# EasyEDA Pro project ProPrj_8.29_2025-09-02.epro

# Schematic Schematic1
Board Name: Board1; Create Date: 2025-08-29; Page Name: P1; Project Name: 8.29; Schematic Name: Schematic1; Update Date: 2025-08-29; Company: 嘉立创EDA; Page Size: A4; Version: V1.0
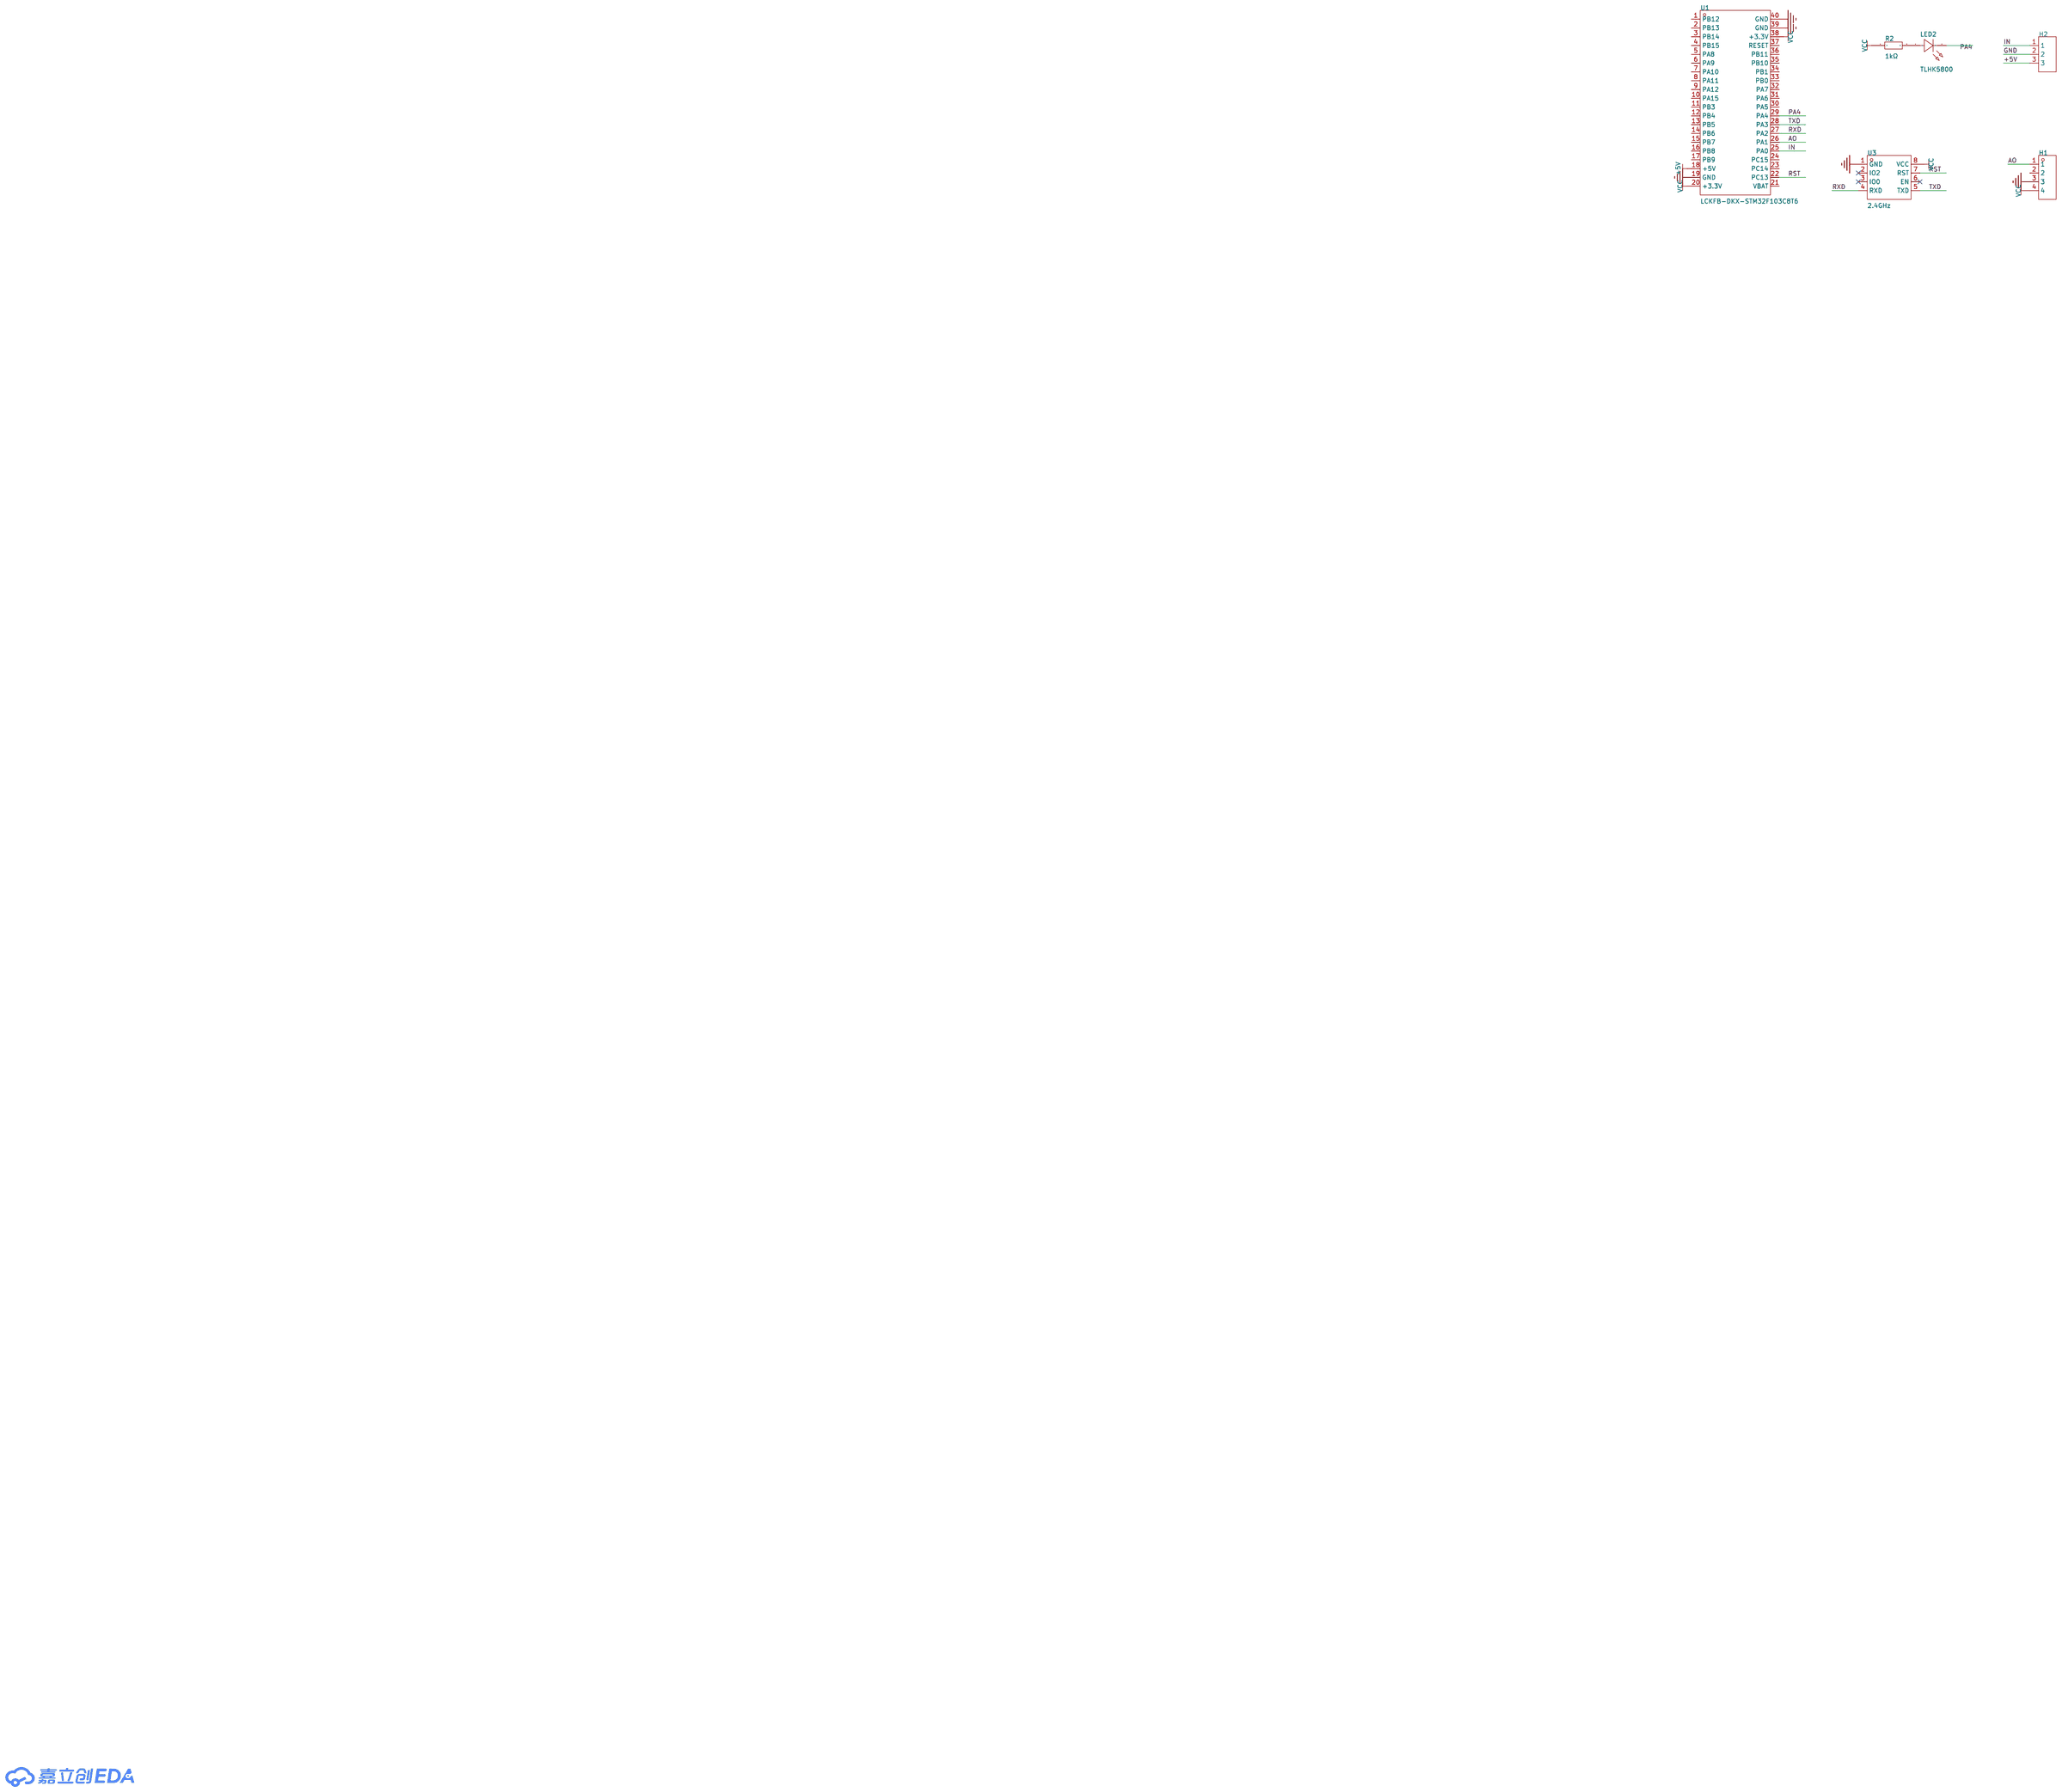
[diagram p0: schematic sheet]

## Parts
H1  -  [HDR-TH_4P-P2.54-V-F]
H2  -  [HDR-TH_3P-P2.54-V-F]
LED2  TLHK5800  [LED-TH_BD5.0-P2.54-RD]
R2  1kΩ  [RES-TH_BD2.5-L6.5-P10.50-D0.6]
U1  LCKFB-DKX-STM32F103C8T6  [CONN-TH_L53.3-W22.9_STM32F103C8T6-CARD]
U3  2.4GHz  [WIFIM-TH_8P-L24.7-W14.4-P2.54]

## Library data of the parts
H1 = HDR-F_2.54_1x4P: Supplier Part: C2718488; Supplier Footprint: 插件
H2 = HDR-F_2.54_1x3P: Supplier Part: C541850; Supplier Footprint: 插件
LED2 = TLHK5800: 发光颜色:红色;正向压降(Vf):1.9V;功率:80mW;正向电流:20mA;波长:630nm;透镜颜色:无色透明透镜;发光强度:5500mcd;发光角度:8°;工作温度:-40℃~+100℃;; Supplier Part: C7400546; Manufacturer: VISHAY(威世); Supplier Footprint: 插件; JLCPCB Part Class: 扩展库; Datasheet: https://item.szlcsc.com/datasheet/TLHK5800/8372711.html; Supplier: LCSC; Illumination Color: 红色; Voltage - Forward(Vf): 1.9V; Power(Watts): 80mW; Forward Current: 20mA; Wavelength - Dominant: 630nm; Peak Wavelength: 643nm; Lens Color: 无色透明透镜; Luminous Intensity: 5500mcd; Viewing Angle: 8°; Operating Temperature: -40℃~+100℃
R2 = MFR0W4F1001A50: 电阻类型:金属膜电阻;阻值:1kΩ;精度:±1%;功率:250mW;温度系数:±50ppm/℃;; LCSC Part Name: 1kΩ ±1% 250mW 金属膜电阻 铜脚，圆柱状直插; Supplier Part: C57435; Manufacturer: UNI-ROYAL(厚声); Supplier Footprint: 插件,D2.2xL6.5mm; JLCPCB Part Class: 扩展库; Datasheet: https://atta.szlcsc.com/upload/public/pdf/source/20191012/C436293_8820AA14BC71FA35E551C06C441482A0.pdf; Supplier: LCSC; Type: 金属膜电阻; Tolerance: ±1%; Voltage-Supply(Max): 250V; Power(Watts): 250mW; Temperature Coefficient: ±50ppm/℃
U1 = LCKFB-DKX-STM32F103C8T6: LCSC Part Name: 立创·地阔星-STM32F103C8T6开发板; Supplier Part: C22396880; Manufacturer: 立创开发板; JLCPCB Part Class: 扩展库; Datasheet: https://item.szlcsc.com/datasheet/LCKFB-DKX-STM32F103C8T6/24005615.html; Supplier: LCSC
U3 = ESP-01S: 核心处理器:ESP8266芯片;频率:2.4GHz;天线形式:板载PCB天线;发射功率:16dBm;接收灵敏度:-90dBm;; LCSC Part Name: 完整的802.11b/g/nWi-FiSoC模块; Supplier Part: C503582; Manufacturer: Ai-Thinker(安信可); JLCPCB Part Class: 扩展库; Datasheet: https://atta.szlcsc.com/upload/public/pdf/source/20200407/C503582_1139AF8FB42E05635FA0089E1752A536.pdf; Supplier: LCSC; Core Processor: ESP8266芯片; Support Interface: GPIO；UART；PWM; Antenna Type: 板载PCB天线; Output Power: 16dBm; Operating Voltage: 3V~3.6V; Receive  Current: 56mA; Send  Current: 170mA; Sensitivity: -90dBm; Operating Temperature: -20℃~+70℃

## Nets
+5V: H2.3 U1.18(+5V)
GND: H1.3 H2.2 U1.19(GND) U1.39(GND) U1.40(GND) U3.1(GND)
VCC: H1.4 R2.1 U1.20(+3.3V) U1.38(+3.3V) U3.8(VCC)
AO: H1.1 U1.26(PA1)
IN: H2.1 U1.25(PA0)
PA4: LED2.2(K) U1.29(PA4)
RST: U1.22(PC13) U3.7(RST)
RXD: U1.27(PA2) U3.4(RXD)
TXD: U1.28(PA3) U3.5(TXD)
$1N1094: LED2.1(A) R2.2

Not connected (* = marked no-connect by the designer): H1 2; U1 1(PB12) 2(PB13) 3(PB14) 4(PB15) 5(PA8) 6(PA9) 7(PA10) 8(PA11) 9(PA12) 10(PA15) 11(PB3) 12(PB4) 13(PB5) 14(PB6) 15(PB7) 16(PB8) 17(PB9) 21(VBAT) 23(PC14) 24(PC15) 30(PA5) 31(PA6) 32(PA7) 33(PB0) 34(PB1) 35(PB10) 36(PB11) 37(RESET); U3 2(IO2)* 3(IO0)* 6(EN)*

# Board PCB1
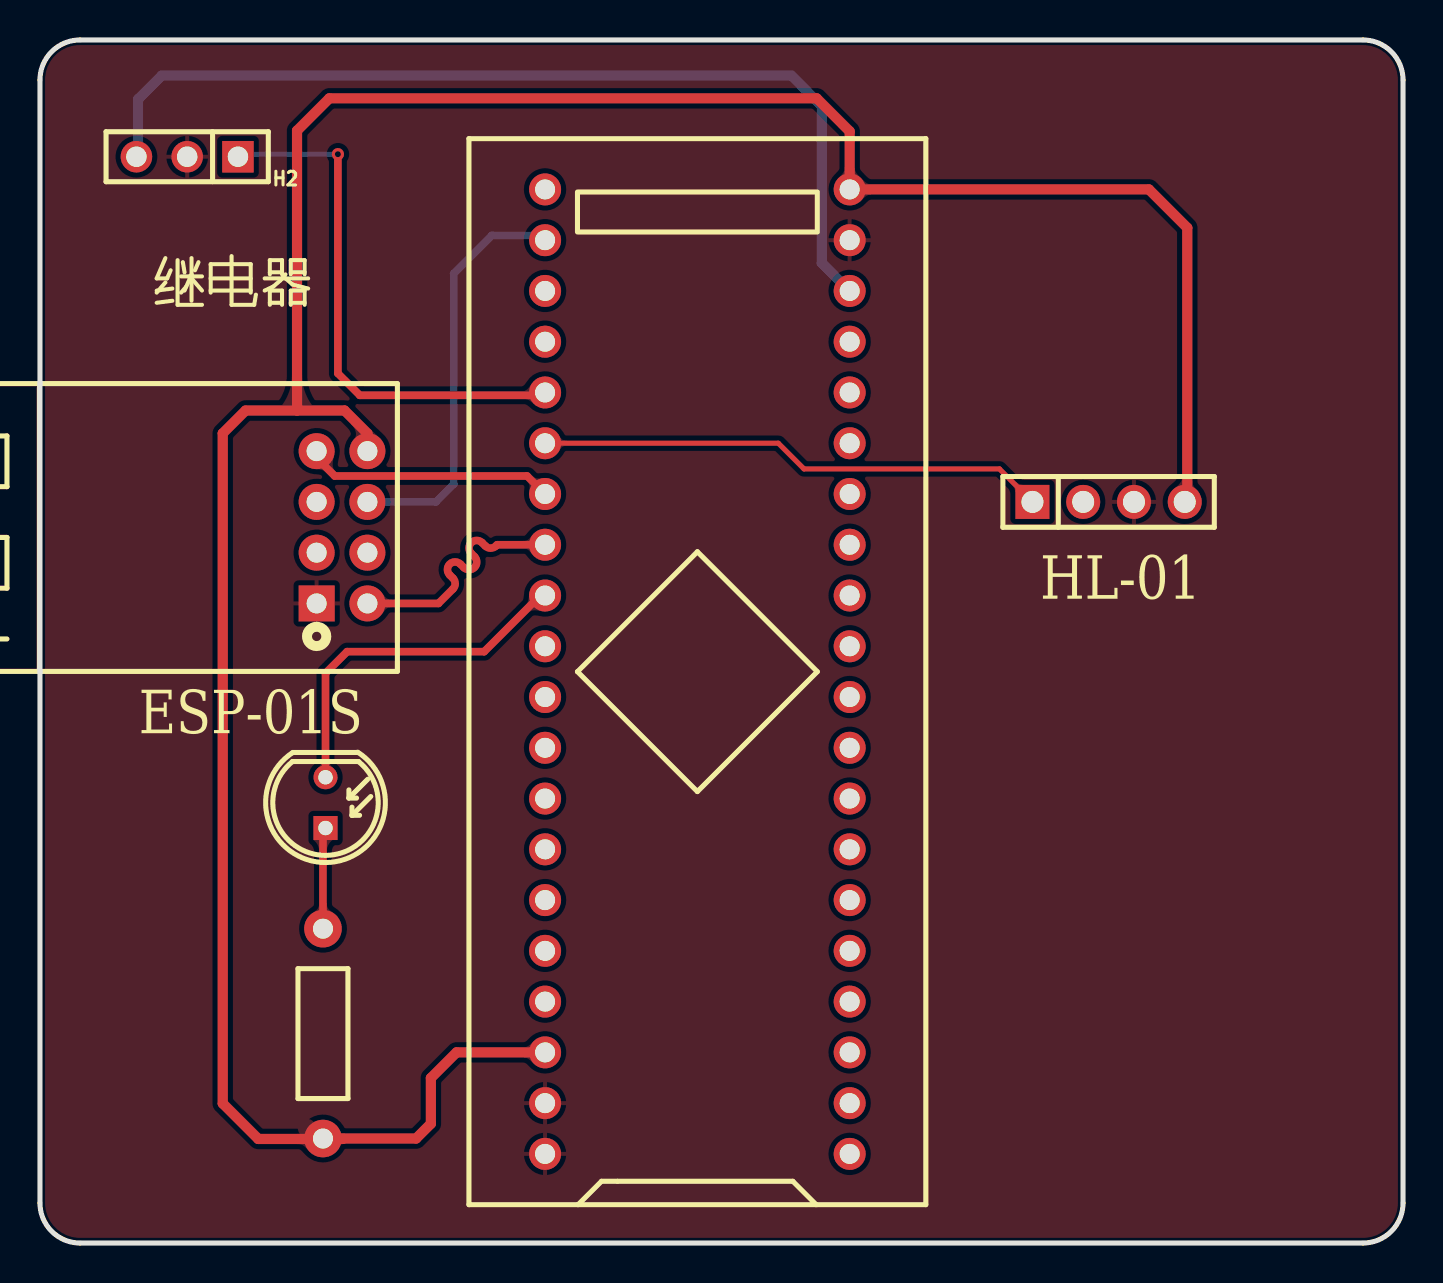
[diagram p1: board, top side]
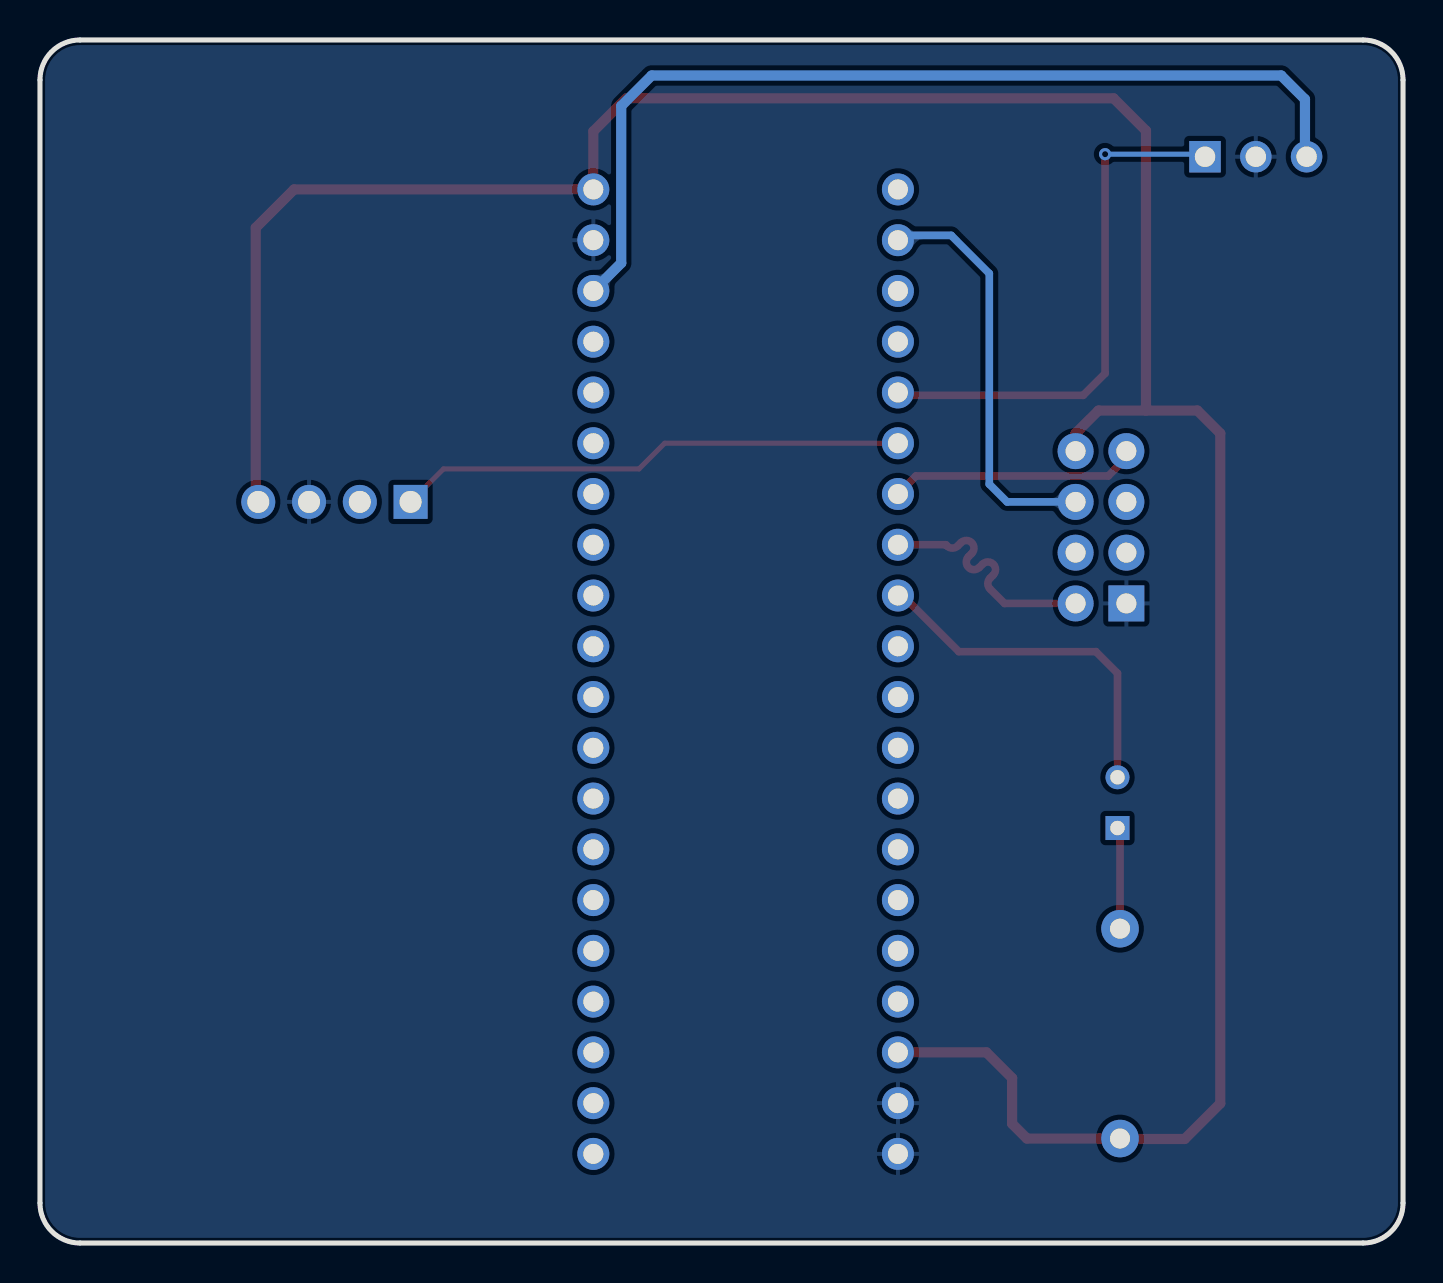
[diagram p2: board, bottom side, seen from below]

Outline 68.2 x 60.2 mm; copper layers: Top Layer, Bottom Layer. Coordinates in mm from the lower left corner of the outline.
Outline path: 0,58.2 0,2 arc(0.59,0.59) 2,0 66.2,0 arc(67.61,0.59) 68.2,2 68.2,58.2 arc(67.61,59.61) 66.2,60.2 2,60.2 arc(0.59,59.61) 0,58.2
Stack: Top Layer 0.035mm / Dielectric1 1.51mm FR4 er 4.5 / Bottom Layer 0.035mm

## Design rules (mm)
net RXD: DP1
net TXD: DP1
template: JLCPCB Capability(Two Layers Board)
spacing copperThickness1oz (default): track to track 0.102, other pairs 0.152 to 0.3
spacing copperThickness2oz: track to track 0.203, other pairs 0.152 to 0.3
track width copperThickness1oz (default): min 0.127, default 0.254, max 2.54
track width copperThickness2oz: min 0.203, default 0.254, max 2.54
differential pair differentialPair (default): width min 0.127, default 0.254, max 2.54; gap min 0.152, default 0.152
via viaSize (default): diameter min 0.5, default 0.61, max 10; hole min 0.3, default 0.305, max 6.3

## Placement (name value [footprint] x y rotation side)
H1  -  [HDR-TH_4P-P2.54-V-F]  53.47 37.08 0 top
H2  -  [HDR-TH_3P-P2.54-V-F]  7.37 54.36 180 top
LED2  TLHK5800  [LED-TH_BD5.0-P2.54-RD]  14.29 22.04 270 top
R2  1kΩ  [RES-TH_BD2.5-L6.5-P10.50-D0.6]  14.16 10.48 90 top
U1  LCKFB-DKX-STM32F103C8T6  [CONN-TH_L53.3-W22.9_STM32F103C8T6-CARD]  32.89 28.59 90 top
U3  2.4GHz  [WIFIM-TH_8P-L24.7-W14.4-P2.54]  15.11 35.81 180 top

## Footprints (pads in the part's own frame, mm; a bottom-side part is the same pattern mirrored in y, then rotated)
CONN-TH_L53.3-W22.9_STM32F103C8T6-CARD
  round 1.6 hole 1: 1(-24.13,-7.62) 2(-21.59,-7.62) 3(-19.05,-7.62) 4(-16.51,-7.62) 5(-13.97,-7.62) 6(-11.43,-7.62) 7(-8.89,-7.62) 8(-6.35,-7.62) 9(-3.81,-7.62) 10(-1.27,-7.62) 11(1.27,-7.62) 12(3.81,-7.62) 13(6.35,-7.62) 14(8.89,-7.62) 15(11.43,-7.62) 16(13.97,-7.62) 17(16.51,-7.62) 18(19.05,-7.62) 19(21.59,-7.62) 20(24.13,-7.62) 21(24.13,7.62) 22(21.59,7.62) 23(19.05,7.62) 24(16.51,7.62) 25(13.97,7.62) 26(11.43,7.62) 27(8.89,7.62) 28(6.35,7.62) 29(3.81,7.62) 30(1.27,7.62) 31(-1.27,7.62) 32(-3.81,7.62) 33(-6.35,7.62) 34(-8.89,7.62) 35(-11.43,7.62) 36(-13.97,7.62) 37(-16.51,7.62) 38(-19.05,7.62) 39(-21.59,7.62) 40(-24.13,7.62)
HDR-TH_3P-P2.54-V-F
  rect 1.575x1.575 hole 1.02: 1(-2.54,0)
  round 1.575 hole 1.02: 2(0,0) 3(2.54,0)
HDR-TH_4P-P2.54-V-F
  rect 1.7x1.7 hole 1.1: 1(-3.81,0)
  round 1.7 hole 1.1: 2(-1.27,0) 3(1.27,0) 4(3.81,0)
LED-TH_BD5.0-P2.54-RD
  rect 1.2x1.2 hole 0.72: 1(1.27,0)
  round 1.2 hole 0.72: 2(-1.27,0)
RES-TH_BD2.5-L6.5-P10.50-D0.6
  round 1.879 hole 1: 1(-5.25,0) 2(5.25,0)
WIFIM-TH_8P-L24.7-W14.4-P2.54
  rect 1.8x1.8 hole 1: 1(1.27,3.81)
  round 1.8 hole 1: 2(1.27,1.27) 3(1.27,-1.27) 4(1.27,-3.81) 5(-1.27,3.81) 6(-1.27,1.27) 7(-1.27,-1.27) 8(-1.27,-3.81)

## Nets
As in the schematic.

Pads without a net: H1 2; U1 1 2 3 4 5 6 7 8 9 10 11 12 13 14 15 16 17 21 23 24 30 31 32 33 34 35 36 37; U3 2 3 6

## Via types
v1: diameter 0.61, hole 0.305, Top Layer to Bottom Layer, 1 via

## Routing (per net, layer and track width the routed paths; a pad name or vN(x,y) marks a point on that pad's centre or on a via; arc(x,y) is an arc through that point)
+5V: length 47.9
  Bottom Layer w0.508: 4.91,54.48 4.91,57.23 6.1,58.42 37.59,58.42 39.12,56.9 39.12,49.04 U1.18
VCC: length 140
  Top Layer w0.508: 12.86,41.66 12.86,55.66 14.48,57.28 38.86,57.28 40.51,55.63 U1.20 55.48,52.72 57.4,50.8 57.4,37.21 H1.4 ; 12.86,41.66 10.29,41.66 9.14,40.51 9.14,6.99 10.92,5.21 15.13,5.21 15.16,5.23 18.82,5.23 19.56,5.97 19.56,8.25 20.84,9.54 U1.38 ; 12.86,41.66 15.24,41.66 16.38,40.51 U3.8
AO: length 25.6
  Top Layer w0.254: H1.1 48.01,38.73 38.23,38.73 36.94,40.02 U1.26
IN: length 26.9
  Top Layer w0.381: U1.25 25.13,42.42 16,42.42 14.91,43.51 v1(14.91,54.48)
  Bottom Layer w0.254: v1(14.91,54.48) 10.03,54.48 H2.1
PA4: length 17.8
  Top Layer w0.381: LED2.2 14.29,28.51 15.37,29.59 22.22,29.59 25.03,32.4 U1.29
RST: length 20.7
  Bottom Layer w0.381: U3.7 19.81,37.08 20.7,37.97 20.7,48.51 22.61,50.42 25.03,50.42 U1.22
RXD: length 12.5
  Top Layer w0.381: U3.4 13.84,39.29 14.75,38.38 24.37,38.38 U1.27
TXD: length 12.7
  Top Layer w0.381: U3.5 19.94,32 20.66,32.73 arc(20.77,33) 20.66,33.27 20.5,33.43 arc(20.5,33.97) 21.04,33.97 21.2,33.81 arc(21.74,33.81) 21.74,34.34 21.58,34.5 arc(21.58,35.04) 22.12,35.04 22.28,34.88 arc(22.55,34.77) 22.82,34.88 22.88,34.94 U1.28
$1N1094: length 5.1
  Top Layer w0.381: LED2.1 14.16,20.64 R2.2

## Copper pours and planes (outline as drawn; the poured copper is in the pictures)
GND on Top Layer: -2.79,63.88 74.04,63.88 74.04,-3.68 -2.79,-3.68
GND on Bottom Layer: -3.56,66.29 69.47,66.29 69.47,-4.06 -3.56,-4.06

Small or netless copper shapes (teardrops, artwork), in the pictures only: 19 on Top Layer, 3 on Bottom Layer

## Text on the board
Top Silkscreen Layer: ESP-01S | 继电器 | HL-01
